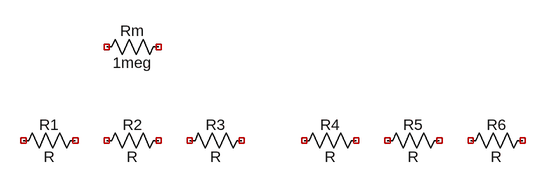
[diagram p0: schematic Uebungsblatt_3_wolfrum.asc]
Uebungsblatt_3_wolfrum.asc, the LTspice schematic file:
Version 4
SHEET 1 888 680
SYMBOL res 208 112 R90
WINDOW 0 7 56 VBottom 2
WINDOW 3 25 56 VTop 2
SYMATTR InstName R1
SYMBOL res 336 112 R90
WINDOW 0 7 56 VBottom 2
WINDOW 3 25 56 VTop 2
SYMATTR InstName R2
SYMBOL res 464 112 R90
WINDOW 0 7 56 VBottom 2
WINDOW 3 25 56 VTop 2
SYMATTR InstName R3
SYMBOL res 640 112 R90
WINDOW 0 7 56 VBottom 2
WINDOW 3 25 56 VTop 2
SYMATTR InstName R4
SYMBOL res 768 112 R90
WINDOW 0 7 56 VBottom 2
WINDOW 3 25 56 VTop 2
SYMATTR InstName R5
SYMBOL res 896 112 R90
WINDOW 0 7 56 VBottom 2
WINDOW 3 25 56 VTop 2
SYMATTR InstName R6
SYMBOL res 336 -32 R90
WINDOW 0 7 56 VBottom 2
WINDOW 3 25 56 VTop 2
SYMATTR InstName Rm
SYMATTR Value 1meg

The netlist it stands for:
* Uebungsblatt_3_wolfrum.asc
R1 NC_01 NC_02 R
R2 NC_03 NC_04 R
R3 NC_05 NC_06 R
R4 NC_07 NC_08 R
R5 NC_09 NC_10 R
R6 NC_11 NC_12 R
Rm NC_13 NC_14 1meg
.backanno
.end